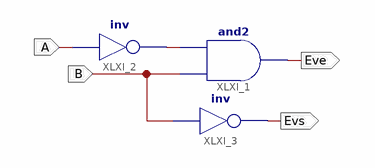
[diagram p0: schematic sheet 1]
// Xilinx ISE schematic ex08.sch (artix7) as structural Verilog: 3 symbols, 4 ports
module ex08 (
  input  B,
  input  A,
  output Eve,
  output Evs
);

  wire XLXN_2;

  and XLXI_1 (Eve, B, XLXN_2);
  not XLXI_3 (Evs, B);
  not XLXI_2 (XLXN_2, A);
endmodule
